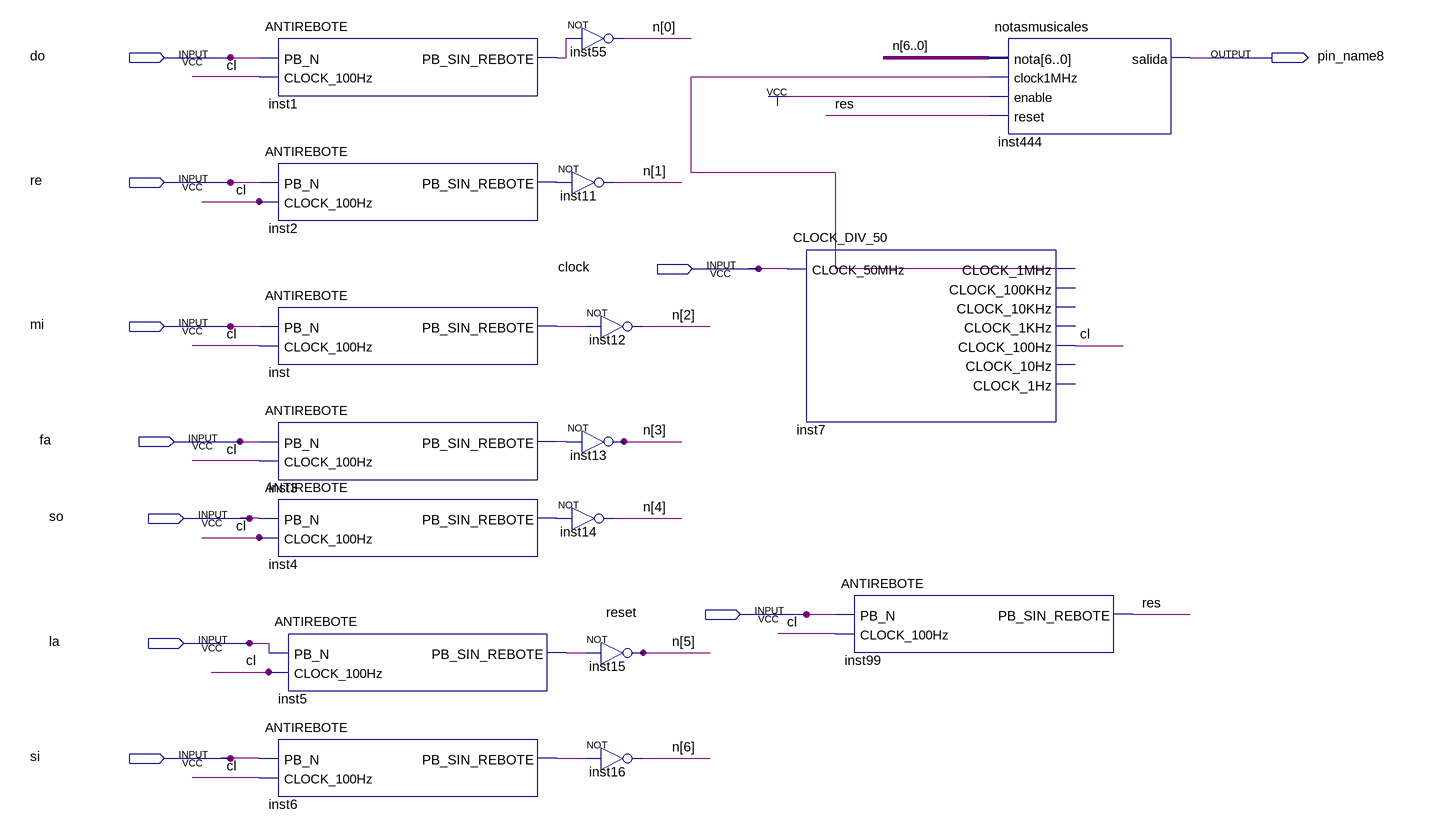
[diagram p0: schematic sheet]
// Quartus schematic Block1.bdf as structural Verilog: 17 symbols, 10 pins
module Block1 (
  input  \do ,
  input  re,
  input  clock,
  input  mi,
  input  fa,
  input  so,
  input  reset,
  input  la,
  input  si,
  output pin_name8
);

  wire cl, inst1_pb_sin_rebote, inst2_pb_sin_rebote, inst3_pb_sin_rebote, inst4_pb_sin_rebote,
       inst5_pb_sin_rebote, inst6_pb_sin_rebote, inst7_clock_1mhz, inst_pb_sin_rebote, res;
  wire [6:0] n;

  ANTIREBOTE inst1 (.PB_N(\do ), .CLOCK_100Hz(cl), .PB_SIN_REBOTE(inst1_pb_sin_rebote));
  ANTIREBOTE inst2 (.PB_N(re), .CLOCK_100Hz(cl), .PB_SIN_REBOTE(inst2_pb_sin_rebote));
  ANTIREBOTE inst (.PB_N(mi), .CLOCK_100Hz(cl), .PB_SIN_REBOTE(inst_pb_sin_rebote));
  ANTIREBOTE inst3 (.PB_N(fa), .CLOCK_100Hz(cl), .PB_SIN_REBOTE(inst3_pb_sin_rebote));
  ANTIREBOTE inst4 (.PB_N(so), .CLOCK_100Hz(cl), .PB_SIN_REBOTE(inst4_pb_sin_rebote));
  ANTIREBOTE inst5 (.PB_N(la), .CLOCK_100Hz(cl), .PB_SIN_REBOTE(inst5_pb_sin_rebote));
  ANTIREBOTE inst6 (.PB_N(si), .CLOCK_100Hz(cl), .PB_SIN_REBOTE(inst6_pb_sin_rebote));
  not inst55 (n[0], inst1_pb_sin_rebote);
  not inst11 (n[1], inst2_pb_sin_rebote);
  not inst12 (n[2], inst_pb_sin_rebote);
  not inst13 (n[3], inst3_pb_sin_rebote);
  not inst14 (n[4], inst4_pb_sin_rebote);
  not inst15 (n[5], inst5_pb_sin_rebote);
  not inst16 (n[6], inst6_pb_sin_rebote);
  CLOCK_DIV_50 inst7 (
    .CLOCK_50MHz(clock), .CLOCK_1MHz(inst7_clock_1mhz), .CLOCK_100Hz(cl));  // open: CLOCK_100KHz, CLOCK_10KHz, CLOCK_1KHz, CLOCK_10Hz, CLOCK_1Hz
  ANTIREBOTE inst99 (.PB_N(reset), .CLOCK_100Hz(cl), .PB_SIN_REBOTE(res));
  notasmusicales inst444 (.nota(n), .clock1MHz(inst7_clock_1mhz), .enable(1'b1), .reset(res), .salida(pin_name8));
endmodule
